# EAGLE board Adafruit NeoTrellis M4 (EAGLE 9.1.3), part 1 of 2
REV: D
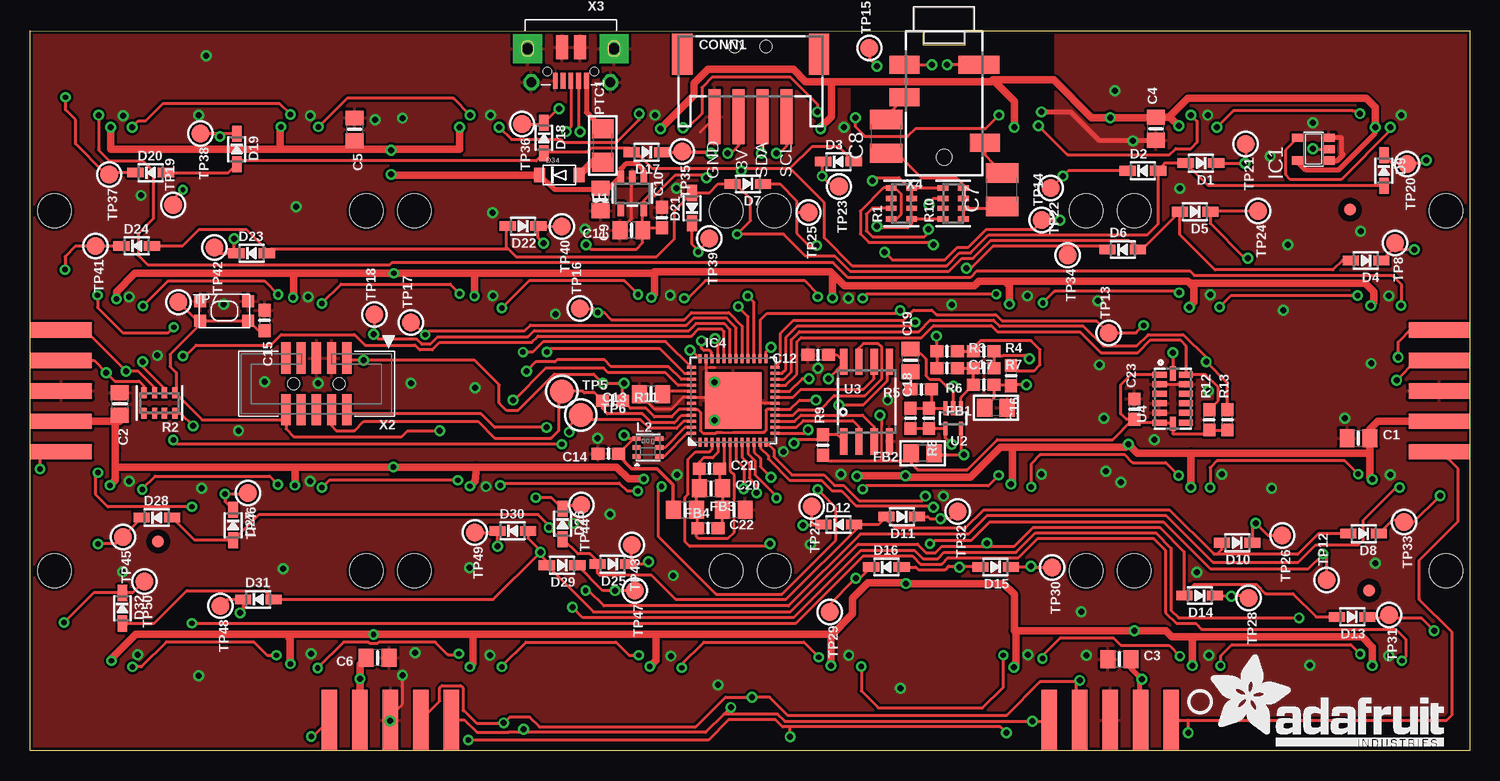
[diagram p3: board, top side]
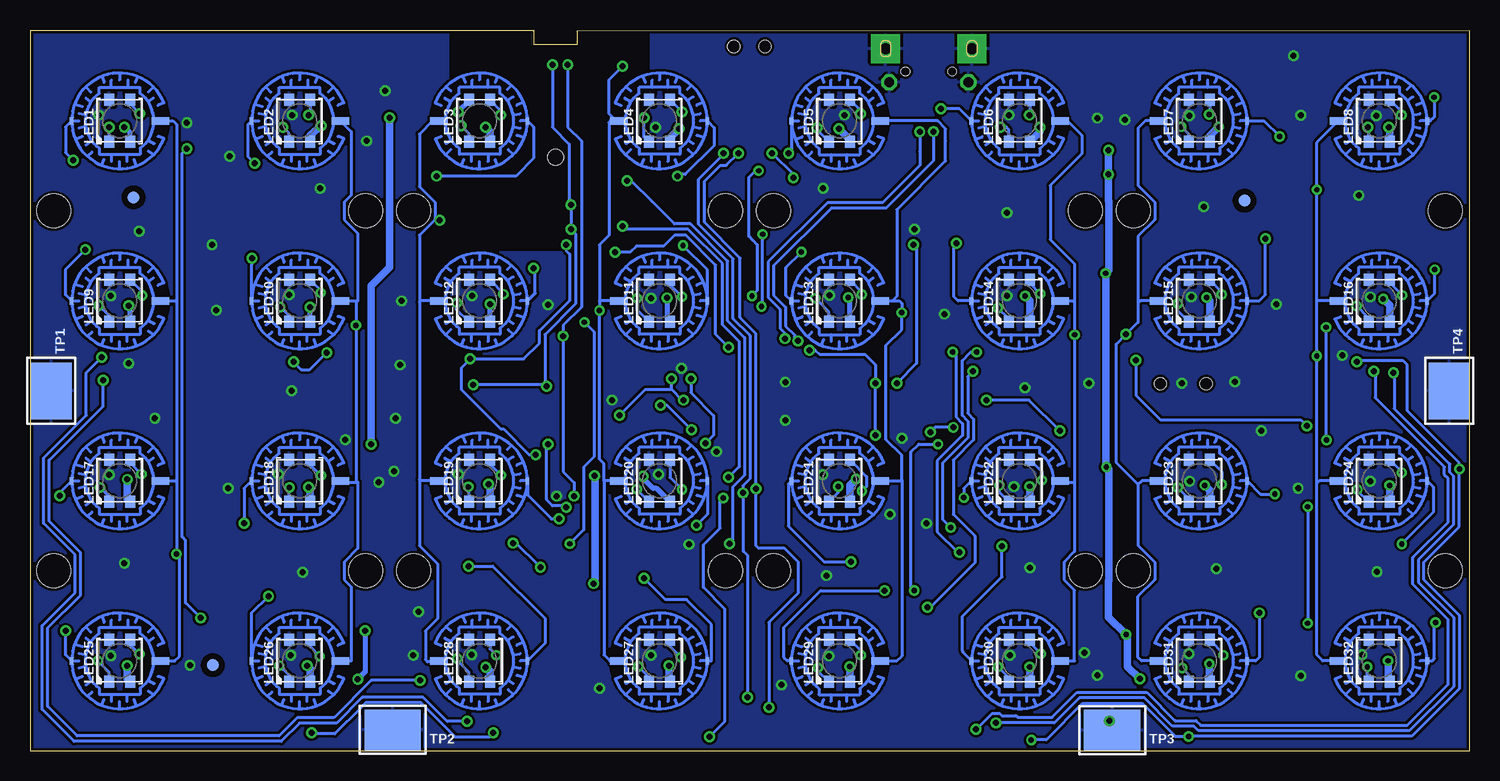
[diagram p4: board, bottom side, seen from below]

Size 120.02 x 60 mm. Coordinates in mm from the lower left corner, seen from the top.
Outline: 120.02,0 0,0 0,60 74.42,59.94 74.42,58.8 77.98,58.8 77.98,60 120.02,60 120.02,0
Copper layers (1*16): Top 0.035mm / dielectric 1.5mm / Bottom 0.035mm
Design rules "adafruit 88 *": minimum track width 8mil, minimum drill 15.5mil, track to track 8mil, track to pad 8mil, pad to pad 8mil, via to via 8mil, smd to smd 8mil, copper to edge 10mil, drill to drill 8mil, minimum pad ring 10mil, minimum via ring 8mil, stop-mask expansion 2mil, vias tented up to drill 20mil, thermal gap 10mil
Net classes: 1 power: width 0.406 mm
Holes 2.8 mm at 118.04,44.97 92.04,44.97 88.04,44.97 62.04,44.97 118.04,14.97 92.04,14.97 88.04,14.97 62.04,14.97 58.04,44.97 32.04,44.97 28.04,44.97 2.04,44.97 58.04,14.97 32.04,14.97 28.04,14.97 2.04,14.97
Holes 1 mm at 61.34,58.67 58.74,58.67
tKeepout: area 0,0 to 6.3,59.9; area 31.7,0 to 38.1,59.9; area 82.5,0 to 88.9,59.9; area 113.7,0 to 120,59.9; area 0,0 to 120,6.3; area 0,53.6 to 31.8,59.9; area 88.2,53.6 to 120,60; area 38,6.3 to 82.5,14.4; area 38.1,34.7 to 82.5,42.3

## Footprints (pad centres in the part's own frame; a part is rotated, then mirrored left to right if it is on the bottom)
0805-NO = smd 1.24 x 1.5: 1 -0.95,0; 2 0.95,0
C1210 = smd 1.6 x 2.7: 1 -1.4,0; 2 1.4,0
0603-NO = smd 1.075 x 1: 1 -0.85,0; 2 0.85,0
JSTPH4 = smd 1 x 4.6: 1 -3,-3.7; 2 -1,-3.7; 3 1,-3.7; 4 3,-3.7 | smd 1.7 x 3.4: NC1 -5.7,1.5; NC2 5.7,1.5
SOD-323 = smd 1.35 x 0.8: A 1.27,0; C -1.27,0
SOD-123FL = smd 0.91 x 1.22: A 1.637,0; C -1.637,0
0805 = smd 1.3 x 1.5: 1 -0.95,0; 2 0.95,0
FIDUCIAL_1MM = smd 1 x 1: 1 0,0
SOT23-5 = smd 0.69 x 0.99: 1 -0.95,-1.29; 2 0,-1.29; 3 0.95,-1.29; 4 0.95,1.3; 5 -0.95,1.3
TQFN48_7MM = smd 0.25 x 0.75: 1 -2.75,-3.475; 2 -2.25,-3.475; 3 -1.75,-3.475; 4 -1.25,-3.475; 5 -0.75,-3.475; 6 -0.25,-3.475; 7 0.25,-3.475; 8 0.75,-3.475; 9 1.25,-3.475; 10 1.75,-3.475; 11 2.25,-3.475; 12 2.75,-3.475; 25 2.75,3.475; 26 2.25,3.475; 27 1.75,3.475; 28 1.25,3.475; 29 0.75,3.475; 30 0.25,3.475; 31 -0.25,3.475; 32 -0.75,3.475; 33 -1.25,3.475; 34 -1.75,3.475; 35 -2.25,3.475; 36 -2.75,3.475 | smd 0.75 x 0.25: 13 3.475,-2.75; 14 3.475,-2.25; 15 3.475,-1.75; 16 3.475,-1.25; 17 3.475,-0.75; 18 3.475,-0.25; 19 3.475,0.25; 20 3.475,0.75; 21 3.475,1.25; 22 3.475,1.75; 23 3.475,2.25; 24 3.475,2.75; 37 -3.475,2.75; 38 -3.475,2.25; 39 -3.475,1.75; 40 -3.475,1.25; 41 -3.475,0.75; 42 -3.475,0.25; 43 -3.475,-0.25; 44 -3.475,-0.75; 45 -3.475,-1.25; 46 -3.475,-1.75; 47 -3.475,-2.25; 48 -3.475,-2.75 | smd 4.7 x 4.7: THERMAL 0,0
5P_EDGECONNECT = smd 1.27 x 5.08: 1 -5.08,0; 2 -2.54,0; 3 0,0; 4 2.54,0; 5 5.08,0
APA102_2020 = smd 0.7 x 0.35: 1 -0.95,-0.75; 2 -0.95,0; 3 -0.95,0.75; 4 0.95,0.75; 5 0.95,0; 6 0.95,-0.75
LED3535 = smd 1 x 0.85: 1 -1.75,0.875; 2 -1.75,-0.875; 3 1.75,-0.875; 4 1.75,0.875
1206 = smd 1.6 x 1.8: 1 -1.4,0; 2 1.4,0
RESPACK_4X0603 = smd 0.45 x 0.9: 1 -1.3,-0.85; 2 -0.4,-0.85; 3 0.4,-0.85; 4 1.3,-0.85; 5 1.3,0.85; 6 0.4,0.85; 7 -0.4,0.85; 8 -1.3,0.85
KMR2 = smd 1 x 1: 1 2,0.8; 2 2,-0.8; 3 -2,0.8; 4 -2,-0.8
TESTPOINT_SMT = smd 4.7 x 3.4: P$1 0,0
TESTPOINT_ROUND_2MM = smd 2 x 2: P$1 0,0
TESTPOINT_ROUND_1.5MM = smd 1.5 x 1.5: P$1 0,0
SOT23-5' = smd 0.55 x 1.2: 1 -0.95,-1.3; 2 0,-1.3; 3 0.95,-1.3; 4 0.95,1.3; 5 -0.95,1.3
SC70-5 = smd 0.35 x 1.15: 1 -0.65,-0.85; 2 0,-0.85; 3 0.65,-0.85; 4 0.65,0.85; 5 -0.65,0.85
SOIC8_208MIL = smd 0.6 x 2.2: 1 -1.905,-3.315; 2 -0.635,-3.315; 3 0.635,-3.315; 4 1.905,-3.315; 5 1.905,3.315; 6 0.635,3.315; 7 -0.635,3.315; 8 -1.905,3.315
LGA14 = smd 0.5 x 1.2: 1 2,1.1; 2 1.2,1.1; 3 0.4,1.1; 4 -0.4,1.1; 5 -1.2,1.1; 6 -2,1.1; 8 -2,-1.1; 9 -1.2,-1.1; 10 -0.4,-1.1; 11 0.4,-1.1; 12 1.2,-1.1; 13 2,-1.1 | smd 1.2 x 0.5: 7 -2.1,0; 14 2.1,0
ELAST_PAD_SQUARE_10MM_4X4WIDE = smd 1.45 x 0.635: P$1 -3.4,0 | smd 0.305 x 0.61: P$2 4,0
2X05_1.27MM_BOX_POSTS = smd 0.76 x 2.6: 1 -2.54,-2.15; 2 -2.54,2.15; 3 -1.27,-2.15; 4 -1.27,2.15; 5 0,-2.15; 6 0,2.15; 7 1.27,-2.15; 8 1.27,2.15; 9 2.54,-2.15; 10 2.54,2.15 | hole 1: -1.905,0; 1.905,0
4UCONN_20329_NARROW = smd 1 x 2: BASE@1 -0.75,-2; BASE@2 0.75,-2 | smd 0.4 x 1.35: D+ 0,0.775; D- -0.65,0.775; GND 1.3,0.775; ID 0.65,0.775; VBUS -1.3,0.775 | drill 0.8 pad 1.27 octagon: SPRT@1 -3.3,0.9; SPRT@2 3.3,0.9 | drill 0.9 pad 2.413 square: SPRT@3 -3.6,-1.9; SPRT@4 3.6,-1.9 | hole 0.7: -1.95,0; 1.95,0
4UCONN_18510 = smd 1.5 x 2.5: 1-GND 2.8,-3.3; 2-TIP 9.3,3.4; 3-OUTER_SLEEVE 5.5,-3.3 | smd 1.5 x 3.4: 4-INNER_SLEEVE 2.8,2.9 | hole 1.3: 10.5,0

## Placement (x,y rotation side)
C1  10u  [0805-NO]  110.74,26.04 0 top
C2  10u  [0805-NO]  7.49,28.88 270 top
C3  10u  [0805-NO]  90.81,7.63 0 top
C4  10u  [0805-NO]  93.85,51.82 90 top
C5  10u  [0805-NO]  27.05,51.77 270 top
C6  10u  [0805-NO]  28.98,7.72 180 top
C7  100uF  [C1210]  81.03,46.74 90 top
C8  100uF  [C1210]  71.37,51.18 90 top
C9  10µF  [0805-NO]  47.56,45.92 270 top
C10  1uF  [0603-NO]  52.67,44.41 90 top
C11  10µF  [0805-NO]  50.13,43.37 180 top
C12  1uF  [0603-NO]  65.7,32.97 180 top
C13  10uF  [0805-NO]  51.78,29.71 180 top
C14  1uF  [0603-NO]  48.21,24.75 180 top
C15  0.1uF  [0603-NO]  19.55,35.84 270 top
C16  0.1µF  [0603-NO]  81.79,31.24 270 top
C17  0.01uF  [0603-NO]  76.45,31.88 0 top
C18  100pF  [0603-NO]  73.41,27.69 90 top
C19  10uF  [0805-NO]  73.41,32.51 90 top
C20  10uF  [0805-NO]  56.77,21.84 0 top
C21  1uF  [0603-NO]  56.64,23.5 0 top
C22  1uF  [0603-NO]  56.52,18.54 0 top
C23  0.1uF  [0603-NO]  92.08,28.45 90 top
CONN1  STEMMA_I2C_RASMT  [JSTPH4]  60.07,56.52 0 top
D1  1N4148  [SOD-323]  97.61,48.95 180 top
D2  1N4148  [SOD-323]  92.77,48.32 0 top
D3  1N4148  [SOD-323]  67.39,49.07 0 top
D4  1N4148  [SOD-323]  111.37,40.84 180 top
D5  1N4148  [SOD-323]  97.11,44.9 180 top
D6  1N4148  [SOD-323]  91.08,41.75 0 top
D7  1N4148  [SOD-323]  59.84,47.21 180 top
D8  1N4148  [SOD-323]  111.17,18.08 180 top
D9  1N4148  [SOD-323]  112.86,48.33 270 top
D10  1N4148  [SOD-323]  100.63,17.32 180 top
D11  1N4148  [SOD-323]  72.68,19.49 180 top
D12  1N4148  [SOD-323]  67.41,18.83 0 top
D13  1N4148  [SOD-323]  110.21,11.14 180 top
D14  1N4148  [SOD-323]  97.51,12.91 180 top
D15  1N4148  [SOD-323]  80.49,15.3 180 top
D16  1N4148  [SOD-323]  71.39,15.29 0 top
D17  1N4148  [SOD-323]  51.41,49.86 180 top
D18  1N4148  [SOD-323]  42.84,51.05 270 top
D19  1N4148  [SOD-323]  17.23,50.12 270 top
D20  1N4148  [SOD-323]  10.06,48.16 0 top
D21  1N4148  [SOD-323]  55.19,45.2 90 top
D22  1N4148  [SOD-323]  41.1,43.7 180 top
D23  1N4148  [SOD-323]  18.48,41.44 0 top
D24  1N4148  [SOD-323]  8.9,42.06 0 top
D25  1N4148  [SOD-323]  48.57,15.53 180 top
D26  1N4148  [SOD-323]  44.39,18.89 270 top
D27  1N4148  [SOD-323]  16.94,18.8 270 top
D28  1N4148  [SOD-323]  10.57,19.41 0 top
D29  1N4148  [SOD-323]  44.36,15.45 180 top
D30  1N4148  [SOD-323]  40.24,18.31 0 top
D31  1N4148  [SOD-323]  19.03,12.59 0 top
D32  1N4148  [SOD-323]  7.7,11.86 270 top
D34  MBR120  [SOD-123FL]  44.13,47.96 0 top
FB1  FERRITE  [0805]  80.52,28.57 180 top
FB2  FERRITE  [0805]  74.42,24.77 180 top
FB3  FERRITE  [0805-NO]  54.61,20.07 0 top
FB4  FERRITE  [0805-NO]  58.67,20.07 180 top
FID1  FIDUCIAL_1MM  [FIDUCIAL_1MM]  10.68,17.43 0 top
FID2  FIDUCIAL_1MM  [FIDUCIAL_1MM]  111.63,13.34 0 top
FID3  FIDUCIAL_1MM  [FIDUCIAL_1MM]  110.04,45.08 0 top
FID4  FIDUCIAL_1MM  [FIDUCIAL_1MM]  111.38,46.1 0 bottom
FID5  FIDUCIAL_1MM  [FIDUCIAL_1MM]  104.78,7.11 0 bottom
FID6  FIDUCIAL_1MM  [FIDUCIAL_1MM]  18.77,45.82 0 bottom
IC1  74HCT1G125DBV  [SOT23-5]  107,50.11 90 top
IC4  ATSAMD51G_TQFN48  [TQFN48_7MM]  58.62,29.17 0 top
JP1  [5P_EDGECONNECT]  2.61,29.97 90 top
JP2  [5P_EDGECONNECT]  117.47,29.97 90 top
JP3  [5P_EDGECONNECT]  30.04,2.54 0 top
JP4  [5P_EDGECONNECT]  90.04,2.54 180 top
L2  AP102-2020  [APA102_2020]  51.51,25.25 0 top
LED1  WS2812B3535  [LED3535]  112.54,52.47 90 bottom
LED2  WS2812B3535  [LED3535]  97.54,52.47 90 bottom
LED3  WS2812B3535  [LED3535]  82.54,52.47 90 bottom
LED4  WS2812B3535  [LED3535]  67.54,52.47 90 bottom
LED5  WS2812B3535  [LED3535]  52.54,52.47 90 bottom
LED6  WS2812B3535  [LED3535]  37.54,52.47 90 bottom
LED7  WS2812B3535  [LED3535]  22.54,52.47 90 bottom
LED8  WS2812B3535  [LED3535]  7.54,52.47 90 bottom
LED9  WS2812B3535  [LED3535]  112.54,37.47 90 bottom
LED10  WS2812B3535  [LED3535]  97.54,37.47 90 bottom
LED11  WS2812B3535  [LED3535]  67.54,37.47 90 bottom
LED12  WS2812B3535  [LED3535]  82.54,37.47 90 bottom
LED13  WS2812B3535  [LED3535]  52.54,37.47 90 bottom
LED14  WS2812B3535  [LED3535]  37.54,37.47 90 bottom
LED15  WS2812B3535  [LED3535]  22.54,37.47 90 bottom
LED16  WS2812B3535  [LED3535]  7.54,37.47 90 bottom
LED17  WS2812B3535  [LED3535]  112.54,22.47 90 bottom
LED18  WS2812B3535  [LED3535]  97.54,22.48 90 bottom
LED19  WS2812B3535  [LED3535]  82.55,22.48 90 bottom
LED20  WS2812B3535  [LED3535]  67.54,22.47 90 bottom
LED21  WS2812B3535  [LED3535]  52.54,22.47 90 bottom
LED22  WS2812B3535  [LED3535]  37.53,22.47 90 bottom
LED23  WS2812B3535  [LED3535]  22.54,22.47 90 bottom
LED24  WS2812B3535  [LED3535]  7.54,22.47 90 bottom
LED25  WS2812B3535  [LED3535]  112.54,7.48 90 bottom
LED26  WS2812B3535  [LED3535]  97.55,7.47 90 bottom
LED27  WS2812B3535  [LED3535]  67.54,7.47 90 bottom
LED28  WS2812B3535  [LED3535]  82.54,7.47 90 bottom
LED29  WS2812B3535  [LED3535]  52.55,7.47 90 bottom
LED30  WS2812B3535  [LED3535]  37.53,7.47 90 bottom
LED31  WS2812B3535  [LED3535]  22.55,7.47 90 bottom
LED32  WS2812B3535  [LED3535]  7.54,7.48 90 bottom
PTC1  500mA Fuse  [1206]  47.75,50.42 90 top
R1  10K  [RESPACK_4X0603]  72.64,45.59 90 top
R2  10K  [RESPACK_4X0603]  10.79,28.96 180 top
R3  1K  [0603-NO]  76.45,33.27 0 top
R4  1K  [0603-NO]  79.5,33.27 0 top
R5  1K  [0603-NO]  74.3,30.1 180 top
R6  1M  [0603-NO]  79.5,30.48 180 top
R7  1M  [0603-NO]  79.5,31.88 0 top
R8  100K  [0603-NO]  74.93,27.69 270 top
R9  10K  [0603-NO]  66.1,25.45 90 top
R10  100  [RESPACK_4X0603]  76.96,45.59 90 top
R11  10K  [0603-NO]  48.56,29.16 0 top
R12  10K  [0603-NO]  98.3,27.56 90 top
R13  10K  [0603-NO]  99.82,27.56 90 top
SW1  SPST_TACT-KMR2  [KMR2]  16.21,36.63 180 top
TP1  [TESTPOINT_SMT]  118.24,29.97 90 bottom
TP2  [TESTPOINT_SMT]  89.79,1.71 0 bottom
TP3  [TESTPOINT_SMT]  29.79,1.71 0 bottom
TP4  [TESTPOINT_SMT]  1.72,29.97 90 bottom
TP5  [TESTPOINT_ROUND_2MM]  44.34,29.92 0 top
TP6  [TESTPOINT_ROUND_2MM]  45.91,27.97 0 top
TP7  [TESTPOINT_ROUND_1.5MM]  12.39,37.36 0 top
TP8  [TESTPOINT_ROUND_1.5MM]  113.79,42.29 270 top
TP12  [TESTPOINT_ROUND_1.5MM]  108.08,14.22 90 top
TP13  [TESTPOINT_ROUND_1.5MM]  89.92,34.8 90 top
TP14  [TESTPOINT_ROUND_1.5MM]  84.33,44.2 90 top
TP15  [TESTPOINT_ROUND_1.5MM]  69.98,58.55 90 top
TP16  [TESTPOINT_ROUND_1.5MM]  45.85,36.83 90 top
TP17  [TESTPOINT_ROUND_1.5MM]  31.75,35.69 90 top
TP18  [TESTPOINT_ROUND_1.5MM]  28.7,36.32 90 top
TP19  [TESTPOINT_ROUND_1.5MM]  11.94,45.47 90 top
TP20  [TESTPOINT_ROUND_1.5MM]  114.81,48.9 270 top
TP21  [TESTPOINT_ROUND_1.5MM]  101.35,50.55 270 top
TP22  [TESTPOINT_ROUND_1.5MM]  85.09,46.86 270 top
TP23  [TESTPOINT_ROUND_1.5MM]  67.44,46.99 270 top
TP24  [TESTPOINT_ROUND_1.5MM]  102.36,44.96 270 top
TP25  [TESTPOINT_ROUND_1.5MM]  64.9,44.83 270 top
TP26  [TESTPOINT_ROUND_1.5MM]  104.39,17.91 270 top
TP27  [TESTPOINT_ROUND_1.5MM]  65.15,20.32 270 top
TP28  [TESTPOINT_ROUND_1.5MM]  101.6,12.7 270 top
TP29  [TESTPOINT_ROUND_1.5MM]  66.67,11.56 270 top
TP30  [TESTPOINT_ROUND_1.5MM]  85.22,15.24 270 top
TP31  [TESTPOINT_ROUND_1.5MM]  113.28,11.3 270 top
TP32  [TESTPOINT_ROUND_1.5MM]  77.34,19.94 270 top
TP33  [TESTPOINT_ROUND_1.5MM]  114.55,19.05 270 top
TP34  [TESTPOINT_ROUND_1.5MM]  86.49,41.27 270 top
TP35  [TESTPOINT_ROUND_1.5MM]  54.36,49.91 270 top
TP36  [TESTPOINT_ROUND_1.5MM]  41.02,52.2 270 top
TP37  [TESTPOINT_ROUND_1.5MM]  6.6,48.01 270 top
TP38  [TESTPOINT_ROUND_1.5MM]  14.22,51.44 270 top
TP39  [TESTPOINT_ROUND_1.5MM]  56.64,42.67 270 top
TP40  [TESTPOINT_ROUND_1.5MM]  44.32,43.69 270 top
TP41  [TESTPOINT_ROUND_1.5MM]  5.46,42.04 270 top
TP42  [TESTPOINT_ROUND_1.5MM]  15.37,41.91 270 top
TP43  [TESTPOINT_ROUND_1.5MM]  50.16,17.14 270 top
TP44  [TESTPOINT_ROUND_1.5MM]  45.97,20.45 270 top
TP45  [TESTPOINT_ROUND_1.5MM]  7.75,17.78 270 top
TP46  [TESTPOINT_ROUND_1.5MM]  18.16,21.46 270 top
TP47  [TESTPOINT_ROUND_1.5MM]  50.42,13.34 270 top
TP48  [TESTPOINT_ROUND_1.5MM]  15.88,12.06 270 top
TP49  [TESTPOINT_ROUND_1.5MM]  37.08,18.16 270 top
TP50  [TESTPOINT_ROUND_1.5MM]  9.53,14.1 270 top
U1  AP2112K-3.3  [SOT23-5']  50.22,46.43 180 top
U2  MAX4466EXK+T  [SC70-5]  76.96,27.69 180 top
U3  GD25x16  [SOIC8_208MIL]  69.74,29.08 0 top
U4  [LGA14]  95.25,29.34 90 top
U$3  [ADAFRUIT_TEXT_20MM]  98.3,0.38 0 top
U$4  ELAST_10X10  [ELAST_PAD_SQUARE_10MM_4X4WIDE]  112.54,52.47 180 bottom
U$5  ELAST_10X10  [ELAST_PAD_SQUARE_10MM_4X4WIDE]  97.54,52.47 180 bottom
U$6  ELAST_10X10  [ELAST_PAD_SQUARE_10MM_4X4WIDE]  82.54,52.47 0 bottom
U$7  ELAST_10X10  [ELAST_PAD_SQUARE_10MM_4X4WIDE]  67.54,52.47 0 bottom
U$8  ELAST_10X10  [ELAST_PAD_SQUARE_10MM_4X4WIDE]  112.54,37.47 180 bottom
U$9  ELAST_10X10  [ELAST_PAD_SQUARE_10MM_4X4WIDE]  97.54,37.47 180 bottom
U$10  ELAST_10X10  [ELAST_PAD_SQUARE_10MM_4X4WIDE]  82.54,37.47 0 bottom
U$11  ELAST_10X10  [ELAST_PAD_SQUARE_10MM_4X4WIDE]  67.54,37.47 0 bottom
U$12  ELAST_10X10  [ELAST_PAD_SQUARE_10MM_4X4WIDE]  112.54,22.47 180 bottom
U$19  ELAST_10X10  [ELAST_PAD_SQUARE_10MM_4X4WIDE]  52.54,52.47 180 bottom
U$23  ELAST_10X10  [ELAST_PAD_SQUARE_10MM_4X4WIDE]  97.54,22.47 180 bottom
U$24  ELAST_10X10  [ELAST_PAD_SQUARE_10MM_4X4WIDE]  67.54,22.47 0 bottom
U$25  ELAST_10X10  [ELAST_PAD_SQUARE_10MM_4X4WIDE]  82.54,22.47 0 bottom
U$26  ELAST_10X10  [ELAST_PAD_SQUARE_10MM_4X4WIDE]  112.54,7.47 180 bottom
U$27  ELAST_10X10  [ELAST_PAD_SQUARE_10MM_4X4WIDE]  97.54,7.47 180 bottom
U$28  ELAST_10X10  [ELAST_PAD_SQUARE_10MM_4X4WIDE]  82.54,7.47 0 bottom
U$29  ELAST_10X10  [ELAST_PAD_SQUARE_10MM_4X4WIDE]  67.54,7.47 0 bottom
U$33  ELAST_10X10  [ELAST_PAD_SQUARE_10MM_4X4WIDE]  37.54,52.47 180 bottom
U$34  ELAST_10X10  [ELAST_PAD_SQUARE_10MM_4X4WIDE]  22.55,52.47 0 bottom
U$35  ELAST_10X10  [ELAST_PAD_SQUARE_10MM_4X4WIDE]  7.54,52.48 0 bottom
U$36  ELAST_10X10  [ELAST_PAD_SQUARE_10MM_4X4WIDE]  52.54,37.47 180 bottom
U$37  ELAST_10X10  [ELAST_PAD_SQUARE_10MM_4X4WIDE]  37.54,37.47 180 bottom
U$38  ELAST_10X10  [ELAST_PAD_SQUARE_10MM_4X4WIDE]  22.55,37.47 0 bottom
U$39  ELAST_10X10  [ELAST_PAD_SQUARE_10MM_4X4WIDE]  7.55,37.47 0 bottom
U$40  ELAST_10X10  [ELAST_PAD_SQUARE_10MM_4X4WIDE]  52.54,22.48 180 bottom
U$41  ELAST_10X10  [ELAST_PAD_SQUARE_10MM_4X4WIDE]  37.54,22.47 180 bottom
U$42  ELAST_10X10  [ELAST_PAD_SQUARE_10MM_4X4WIDE]  7.55,22.47 0 bottom
U$43  ELAST_10X10  [ELAST_PAD_SQUARE_10MM_4X4WIDE]  22.55,22.47 0 bottom
U$44  ELAST_10X10  [ELAST_PAD_SQUARE_10MM_4X4WIDE]  52.55,7.47 180 bottom
U$45  ELAST_10X10  [ELAST_PAD_SQUARE_10MM_4X4WIDE]  37.54,7.47 180 bottom
U$46  ELAST_10X10  [ELAST_PAD_SQUARE_10MM_4X4WIDE]  22.55,7.47 0 bottom
U$47  ELAST_10X10  [ELAST_PAD_SQUARE_10MM_4X4WIDE]  7.54,7.48 0 bottom
U$48  [TRELLISLOGO]  39.24,0 0 top
U$78  [PCBFEAT-REV-040]  97.54,4.06 0 top
X2  2x5 0.05" SWD  [2X05_1.27MM_BOX_POSTS]  23.88,30.56 180 top
X3  microUSB  [4UCONN_20329_NARROW]  45.09,56.59 180 top
X4  4UCONN_18510  [4UCONN_18510]  76.2,59.94 270 top